# EasyEDA schematic 1-Schematic_Picaxe board.json
TITLE: New Schematic; REV: 1.0; Date: 2018-07-18; Sheet: 1/1; Drawn By: jirka.svitil
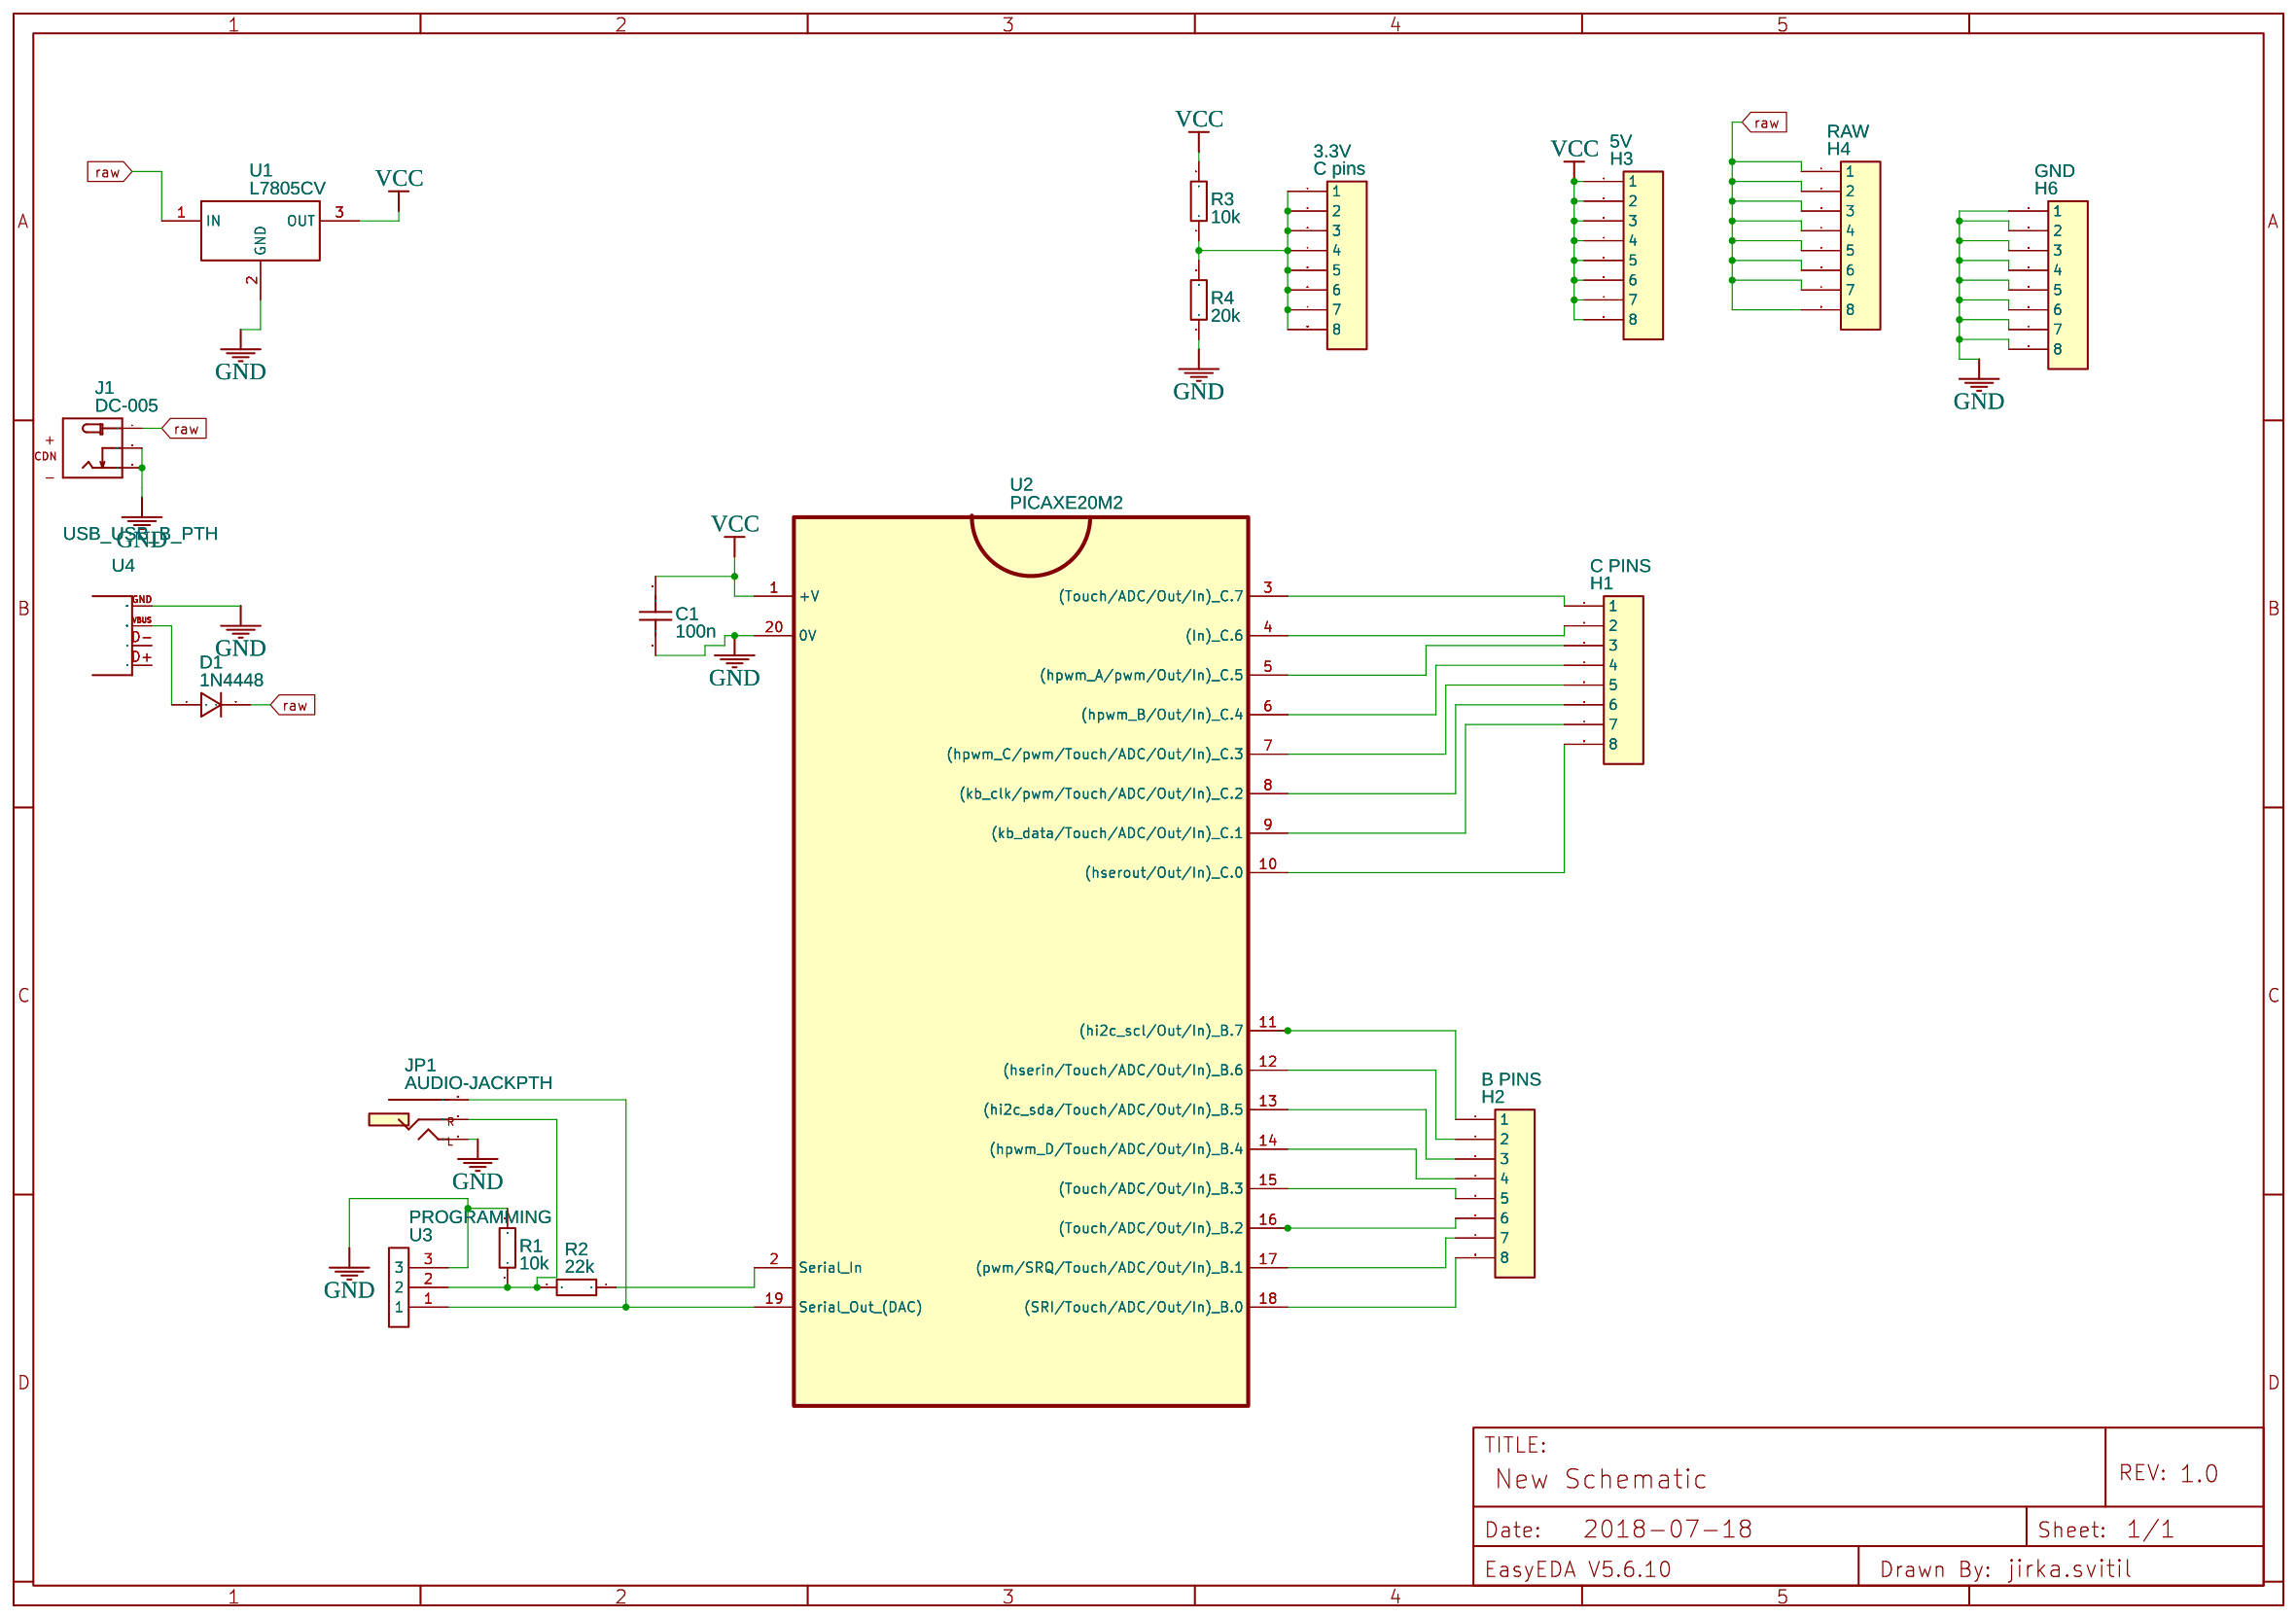
[diagram p0: schematic sheet]

## Parts
3.3V  C pins  [8PIN FEMALE HEADER]
5V  H3  [8PIN FEMALE HEADER]
B PINS  H2  [8PIN FEMALE HEADER]
C1  100n  [RAD-0.1]
C PINS  H1  [8PIN FEMALE HEADER]
D1  1N4448  [DO-35]
GND  H6  [8PIN FEMALE HEADER]
J1  DC-005  [DCJ3P-14.2X11.0X9.0MM]
JP1  AUDIO-JACKPTH  [AUDIO-JACK]
PROGRAMMING  U3  [3PIN HEADER]
R1  10k  [AXIAL-0.3]
R2  22k  [AXIAL-0.3]
R3  10k  [AXIAL-0.3]
R4  20k  [AXIAL-0.3]
RAW  H4  [8PIN FEMALE HEADER]
U1  L7805CV  [TO-220(TO-220-3)]
U2  PICAXE20M2  [DIL-20]
U4  USB_USB_B_PTH  [USB-B-PTH]

## Library data of the parts
3.3V 5V B PINS C PINS GND RAW = -: Manufacturer Part: ?
C1 = Cap_RAD-0.1_US: Manufacturer Part: ?
D1 = -: Supplier: LCSC; Manufacturer: SEMTECH; LCSC: C54037; image: //image.lceda.cn/szlcsc/C54037.jpg
J1 = -: CONN DC POWER JACK 2.1MM
JP1 = -: 3.5mm Audio Jack; Contributor: SparkFun; Manufacturer Part: ?
PROGRAMMING = -: Manufacturer Part: pin 3; Contributor: goldenrice
R1-R4 = Res_AXIAL-0.3(1/8W)_EU: Manufacturer Part: ?
U1 = -: Supplier: LCSC; Manufacturer: STMicroelectronics; LCSC: C111887; Contributor: LCSC
U2 = -: Manufacturer Part: PICAXE; Contributor: robinek
U4 = USB_USB_B_PTH: Contributor: signality; Manufacturer Part: ?

## Nets
GND: C1.1 GND.1 GND.2 GND.3 GND.4 GND.5 GND.6 GND.7 GND.8 J1.-1(-) J1.-2(CDN) JP1.TIP(LEFT) PROGRAMMING.3 R1.2 R4.1 U1.2(GND) U2.20(0V) U4.GND
VCC: 5V.1 5V.2 5V.3 5V.4 5V.5 5V.6 5V.7 5V.8 C1.2 R3.2 U1.3(OUT) U2.1(+V)
raw: D1.2(K) J1.+ RAW.1 RAW.2 RAW.3 RAW.4 RAW.5 RAW.6 RAW.7 RAW.8 U1.1(IN)
Net-(B PINS-1): B PINS.1 U2.11((hi2c scl/Out/In) B.7)
Net-(B PINS-2): B PINS.2 U2.12((hserin/Touch/ADC/Out/In) B.6)
Net-(B PINS-3): B PINS.3 U2.13((hi2c sda/Touch/ADC/Out/In) B.5)
Net-(B PINS-4): B PINS.4 U2.14((hpwm D/Touch/ADC/Out/In) B.4)
Net-(B PINS-5): B PINS.5 U2.15((Touch/ADC/Out/In) B.3)
Net-(B PINS-6): B PINS.6 U2.16((Touch/ADC/Out/In) B.2)
Net-(B PINS-7): B PINS.7 U2.17((pwm/SRQ/Touch/ADC/Out/In) B.1)
Net-(B PINS-8): B PINS.8 U2.18((SRI/Touch/ADC/Out/In) B.0)
PROGRAMMING_2: JP1.RING(RIGHT) PROGRAMMING.2 R1.1 R2.2
R3_1: 3.3V.1 3.3V.2 3.3V.3 3.3V.4 3.3V.5 3.3V.6 3.3V.7 3.3V.8 R3.1 R4.2
U2_2: R2.1 U2.2(Serial In)
U2_3: C PINS.1 U2.3((Touch/ADC/Out/In) C.7)
U2_4: C PINS.2 U2.4((In) C.6)
U2_5: C PINS.3 U2.5((hpwm A/pwm/Out/In) C.5)
U2_6: C PINS.4 U2.6((hpwm B/Out/In) C.4)
U2_7: C PINS.5 U2.7((hpwm C/pwm/Touch/ADC/Out/In) C.3)
U2_8: C PINS.6 U2.8((kb clk/pwm/Touch/ADC/Out/In) C.2)
U2_9: C PINS.7 U2.9((kb data/Touch/ADC/Out/In) C.1)
U2_10: C PINS.8 U2.10((hserout/Out/In) C.0)
U2_19: JP1.SLEEVE PROGRAMMING.1 U2.19(Serial Out (DAC))
U4_VBUS: D1.1(A) U4.VBUS

Not connected (* = marked no-connect by the designer): U4 D+ D-
